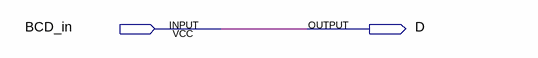
[diagram p0: schematic sheet]
// Quartus schematic DECOD_BCD_D.bdf as structural Verilog: 0 symbols, 2 pins
module DECOD_BCD_D (
  input  BCD_in,
  output D
);


  assign D = BCD_in;
endmodule
